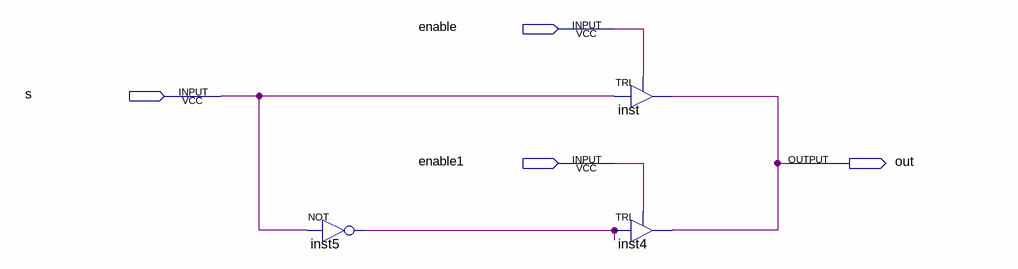
[diagram p0: schematic sheet]
// Quartus schematic multiplexing_logic.bdf as structural Verilog: 3 symbols, 4 pins
module multiplexing_logic (
  input  enable,
  input  s,
  input  enable1,
  output out
);

  wire inst5_out;

  not inst5 (inst5_out, s);
  TRI inst (.IN(s), .OE(enable), .OUT(out));
  TRI inst4 (.IN(inst5_out), .OE(enable1), .OUT(out));
endmodule
